# EAGLE schematic light-sensor (EAGLE 6.6.0)
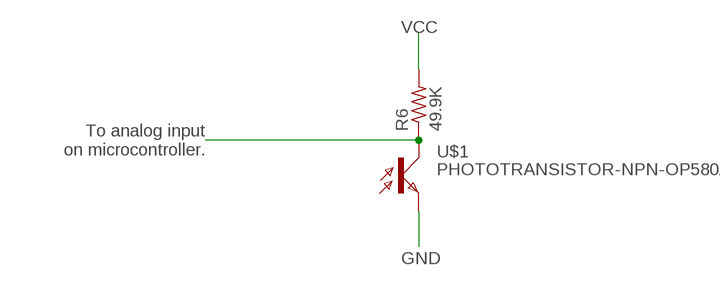
[diagram p0: schematic, sheet 1]

## Parts
R6  49.9K  R-US_R1206  [R1206]
U$1  PHOTOTRANSISTOR-NPN-OP580AD  [OP580DA]

## Nets
GND: U$1.EMITTER(E)
N$7: R6.1 U$1.COLLECTOR(C)
VCC: R6.2

## Notes on the sheet
- To analog input
  on microcontroller.

## Library data of the parts
R6 = rcl:R-US_: RESISTOR, American symbol
U$1 = LED Light:PHOTOTRANSISTOR-NPN